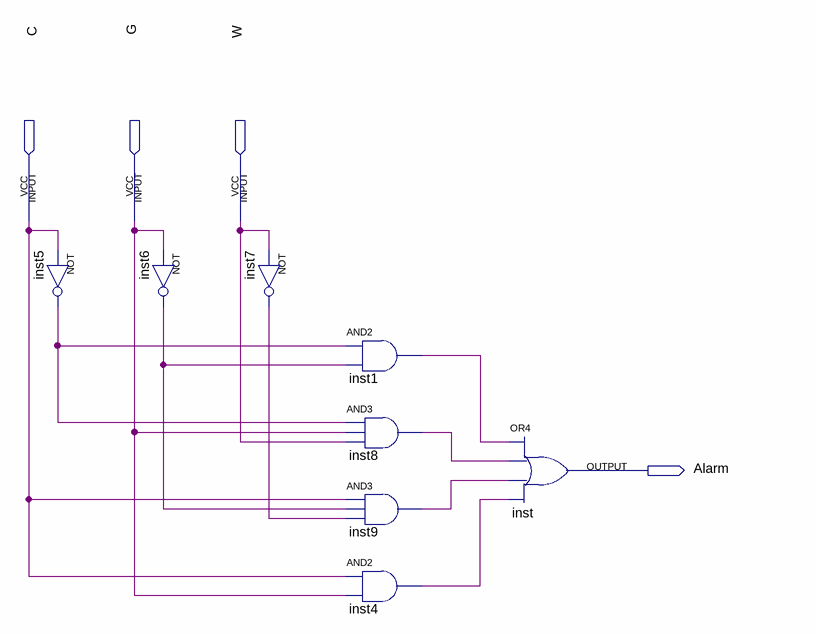
[diagram p0: schematic sheet]
// Quartus schematic lab2step2.bdf as structural Verilog: 8 symbols, 4 pins
module lab2step2 (
  input  C,
  input  G,
  input  W,
  output Alarm
);

  wire inst1_out, inst4_out, inst5_out, inst6_out, inst7_out, inst8_out, inst9_out;

  not inst5 (inst5_out, C);
  not inst6 (inst6_out, G);
  not inst7 (inst7_out, W);
  and inst1 (inst1_out, inst5_out, inst6_out);
  and inst8 (inst8_out, inst5_out, G, W);
  and inst9 (inst9_out, C, inst6_out, inst7_out);
  and inst4 (inst4_out, C, G);
  or inst (Alarm, inst1_out, inst8_out, inst9_out, inst4_out);
endmodule
